# EAGLE design SOIC_20_UNI_7 (EAGLE 5.10)
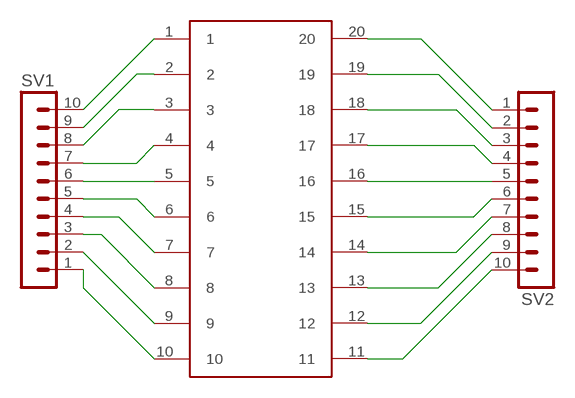
[diagram p0: schematic, sheet 1]

## Parts
SV1  MA10-1  [MA10-1]
SV2  MA10-1  [MA10-1]
U$1  SOIC_20_UNI  [SOIC_20_UNI]

## Nets
N$1: SV1.10 U$1.1
N$2: SV1.9 U$1.2
N$3: SV1.8 U$1.3
N$4: SV1.7 U$1.4
N$5: SV1.6 U$1.5
N$6: SV1.5 U$1.6
N$7: SV1.4 U$1.7
N$8: SV1.3 U$1.8
N$9: SV1.2 U$1.9
N$10: SV1.1 U$1.10
N$11: SV2.10 U$1.11
N$12: SV2.9 U$1.12
N$13: SV2.8 U$1.13
N$14: SV2.7 U$1.14
N$15: SV2.6 U$1.15
N$16: SV2.5 U$1.16
N$17: SV2.4 U$1.17
N$18: SV2.3 U$1.18
N$19: SV2.2 U$1.19
N$20: SV2.1 U$1.20

## Library data of the parts
SV1 SV2 = con-lstb:MA10-1: PIN HEADER
U$1 = custom:SOIC_20_UNI

## Board
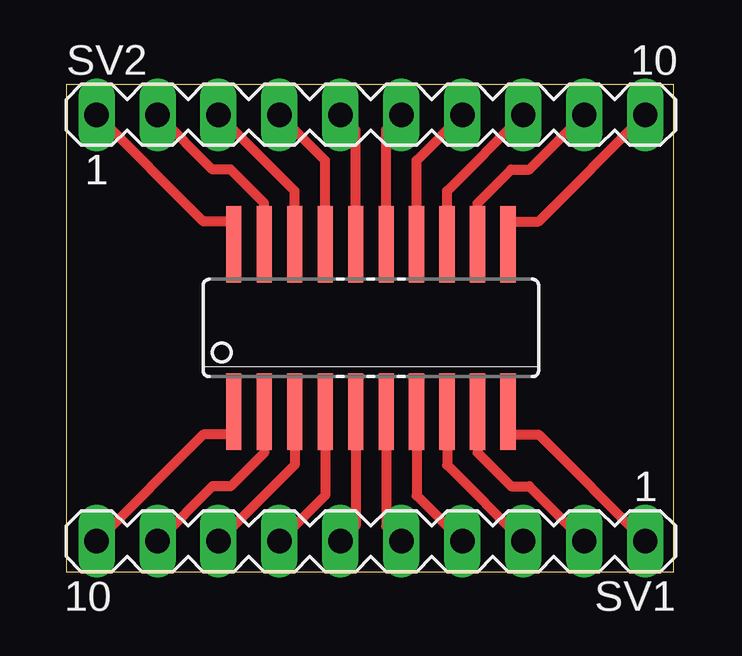
[diagram p1: board, top side]

Size 25.32 x 20.31 mm. Coordinates in mm from the lower left corner, seen from the top.
Outline: 0,0 25.32,0 25.32,20.31 0,20.31 0,0
Copper layers (1*16): Top 0.035mm / dielectric 1.5mm / Bottom 0.035mm
Design rules "default": minimum track width 10mil, minimum drill 24mil, track to track 8mil, track to pad 8mil, pad to pad 8mil, via to via 8mil, smd to smd 8mil, copper to edge 40mil, drill to drill 8mil, minimum pad ring 10mil, minimum via ring 8mil, stop-mask expansion 4mil, vias tented up to drill 0mil, thermal gap 10mil

### Footprints (pad centres in the part's own frame; a part is rotated, then mirrored left to right if it is on the bottom)
MA10-1 = drill 1.016 long: 1 -11.43,0; 2 -8.89,0; 3 -6.35,0; 4 -3.81,0; 5 -1.27,0; 6 1.27,0; 7 3.81,0; 8 6.35,0; 9 8.89,0; 10 11.43,0
SOIC_20_UNI = smd 0.635 x 1.27: 1 -5.715,-4.445; 2 -4.445,-4.445; 3 -3.175,-4.445; 4 -1.905,-4.445; 5 -0.635,-4.445; 6 0.635,-4.445; 7 1.905,-4.445; 8 3.175,-4.445; 9 4.445,-4.445; 10 5.715,-4.445; 11 5.715,4.445; 12 4.445,4.445; 13 3.175,4.445; 14 1.905,4.445; 15 0.635,4.445; 16 -0.635,4.445; 17 -1.905,4.445; 18 -3.175,4.445; 19 -4.445,4.445; 20 -5.715,4.445; P$3 -1.905,2.54; P$4 -1.905,3.175; P$6 -0.635,3.81; P$7 -0.635,2.54; P$8 0.635,2.54; P$9 0.635,3.81; P$12 1.905,3.175; P$13 1.905,2.54; P$14 -1.905,-2.54; P$15 -1.905,-3.81; P$18 -0.635,-3.81; P$19 -0.635,-2.54; P$20 0.635,-2.54; P$21 0.635,-3.81; P$24 1.905,-3.175; P$25 1.905,-2.54; P$29 5.715,2.54; P$30 5.715,3.175; P$31 4.445,3.175; P$32 4.445,2.54; P$33 3.175,2.54; P$34 3.175,3.175; P$35 3.175,-2.54; P$36 3.175,-3.81; P$39 4.445,-3.175; P$40 4.445,-2.54; P$41 5.715,-2.54; P$42 5.715,-3.175; P$45 -3.175,3.175; P$46 -3.175,2.54; P$47 -3.175,-2.54; P$48 -3.175,-3.175; P$51 -4.445,-3.175; P$52 -4.445,-2.54; P$53 -5.715,-2.54; P$54 -5.715,-3.81; P$57 -4.445,3.175; P$58 -4.445,2.54; P$60 -5.715,3.175; P$61 -5.715,2.54

### Placement (x,y rotation side)
SV1  12.7,1.27 180 top
SV2  12.7,19.05 0 top
U$1  12.7,10.16 0 top

### Tracks (layer width: path | path; a pad name or v marks a point on that pad's centre or on a via)
N$1
  Top 0.406: U$1.1 5.71,5.71 SV1.10
N$2
  Top 0.406: U$1.2 8.26,4.95 6.86,3.56 6.1,3.56 SV1.9
N$3
  Top 0.406: U$1.3 9.53,4.45 SV1.8
N$4
  Top 0.406: U$1.4 10.79,3.17 SV1.7
N$5
  Top 0.406: U$1.5 12.06,1.91 SV1.6
N$6
  Top 0.406: U$1.6 13.34,1.91 SV1.5
N$7
  Top 0.406: U$1.7 14.61,3.17 SV1.4
N$8
  Top 0.406: U$1.8 15.88,4.45 SV1.3
N$9
  Top 0.406: U$1.9 17.14,4.95 18.54,3.56 19.3,3.56 SV1.2
N$10
  Top 0.406: U$1.10 19.68,5.71 SV1.1
N$11
  Top 0.406: U$1.11 19.68,14.61 SV2.10
N$12
  Top 0.406: U$1.12 17.14,15.37 18.54,16.76 19.3,16.76 SV2.9
N$13
  Top 0.406: U$1.13 15.88,15.88 SV2.8
N$14
  Top 0.406: U$1.14 14.61,17.14 SV2.7
N$15
  Top 0.406: U$1.15 13.34,18.41 SV2.6
N$16
  Top 0.406: U$1.16 12.06,18.41 SV2.5
N$17
  Top 0.406: U$1.17 10.79,17.14 SV2.4
N$18
  Top 0.406: U$1.18 9.53,15.88 SV2.3
N$19
  Top 0.406: U$1.19 8.26,15.37 6.86,16.76 6.1,16.76 SV2.2
N$20
  Top 0.406: U$1.20 5.71,14.61 SV2.1